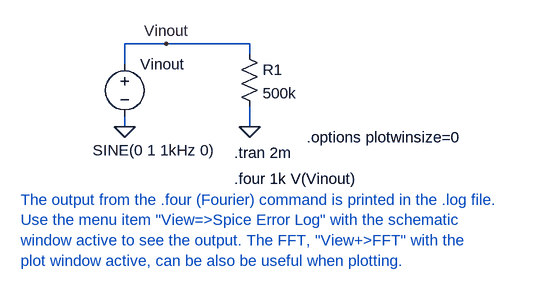
[diagram p0: schematic Fig21_55.asc]
Fig21_55.asc, the LTspice schematic file:
Version 4
SHEET 1 2012 680
WIRE 1104 64 1040 64
WIRE 1232 64 1104 64
WIRE 1232 80 1232 64
WIRE 1040 96 1040 64
WIRE 1040 192 1040 176
WIRE 1232 192 1232 160
FLAG 1040 192 0
FLAG 1232 192 0
FLAG 1104 64 Vinout
SYMBOL voltage 1040 80 R0
WINDOW 3 -49 148 Left 0
WINDOW 123 0 0 Left 0
WINDOW 39 0 0 Left 0
SYMATTR Value SINE(0 1 1kHz 0)
SYMATTR InstName Vinout
SYMBOL res 1216 64 R0
SYMATTR InstName R1
SYMATTR Value 500k
TEXT 1208 232 Left 0 !.tran 2m
TEXT 1208 272 Left 0 !.four 1k V(Vinout)
TEXT 880 304 Left 0 ;The output from the .four (Fourier) command is printed in the .log file.  \nUse the menu item "View=>Spice Error Log" with the schematic \nwindow active to see the output. The FFT, "View+>FFT" with the \nplot window active, can be also be useful when plotting.
TEXT 1320 208 Left 0 !.options plotwinsize=0

The netlist it stands for:
* Fig21_55.asc
Vinout Vinout 0 SINE(0 1 1kHz 0)
R1 Vinout 0 500k
.tran 2m
.four 1k V(Vinout)
* The output from the .four (Fourier) command is printed in the .log file.
* Use the menu item "View=>Spice Error Log" with the schematic
* window active to see the output. The FFT, "View+>FFT" with the
* plot window active, can be also be useful when plotting.
.options plotwinsize=0
.backanno
.end